# Altium project RelayModule.PrjPcb
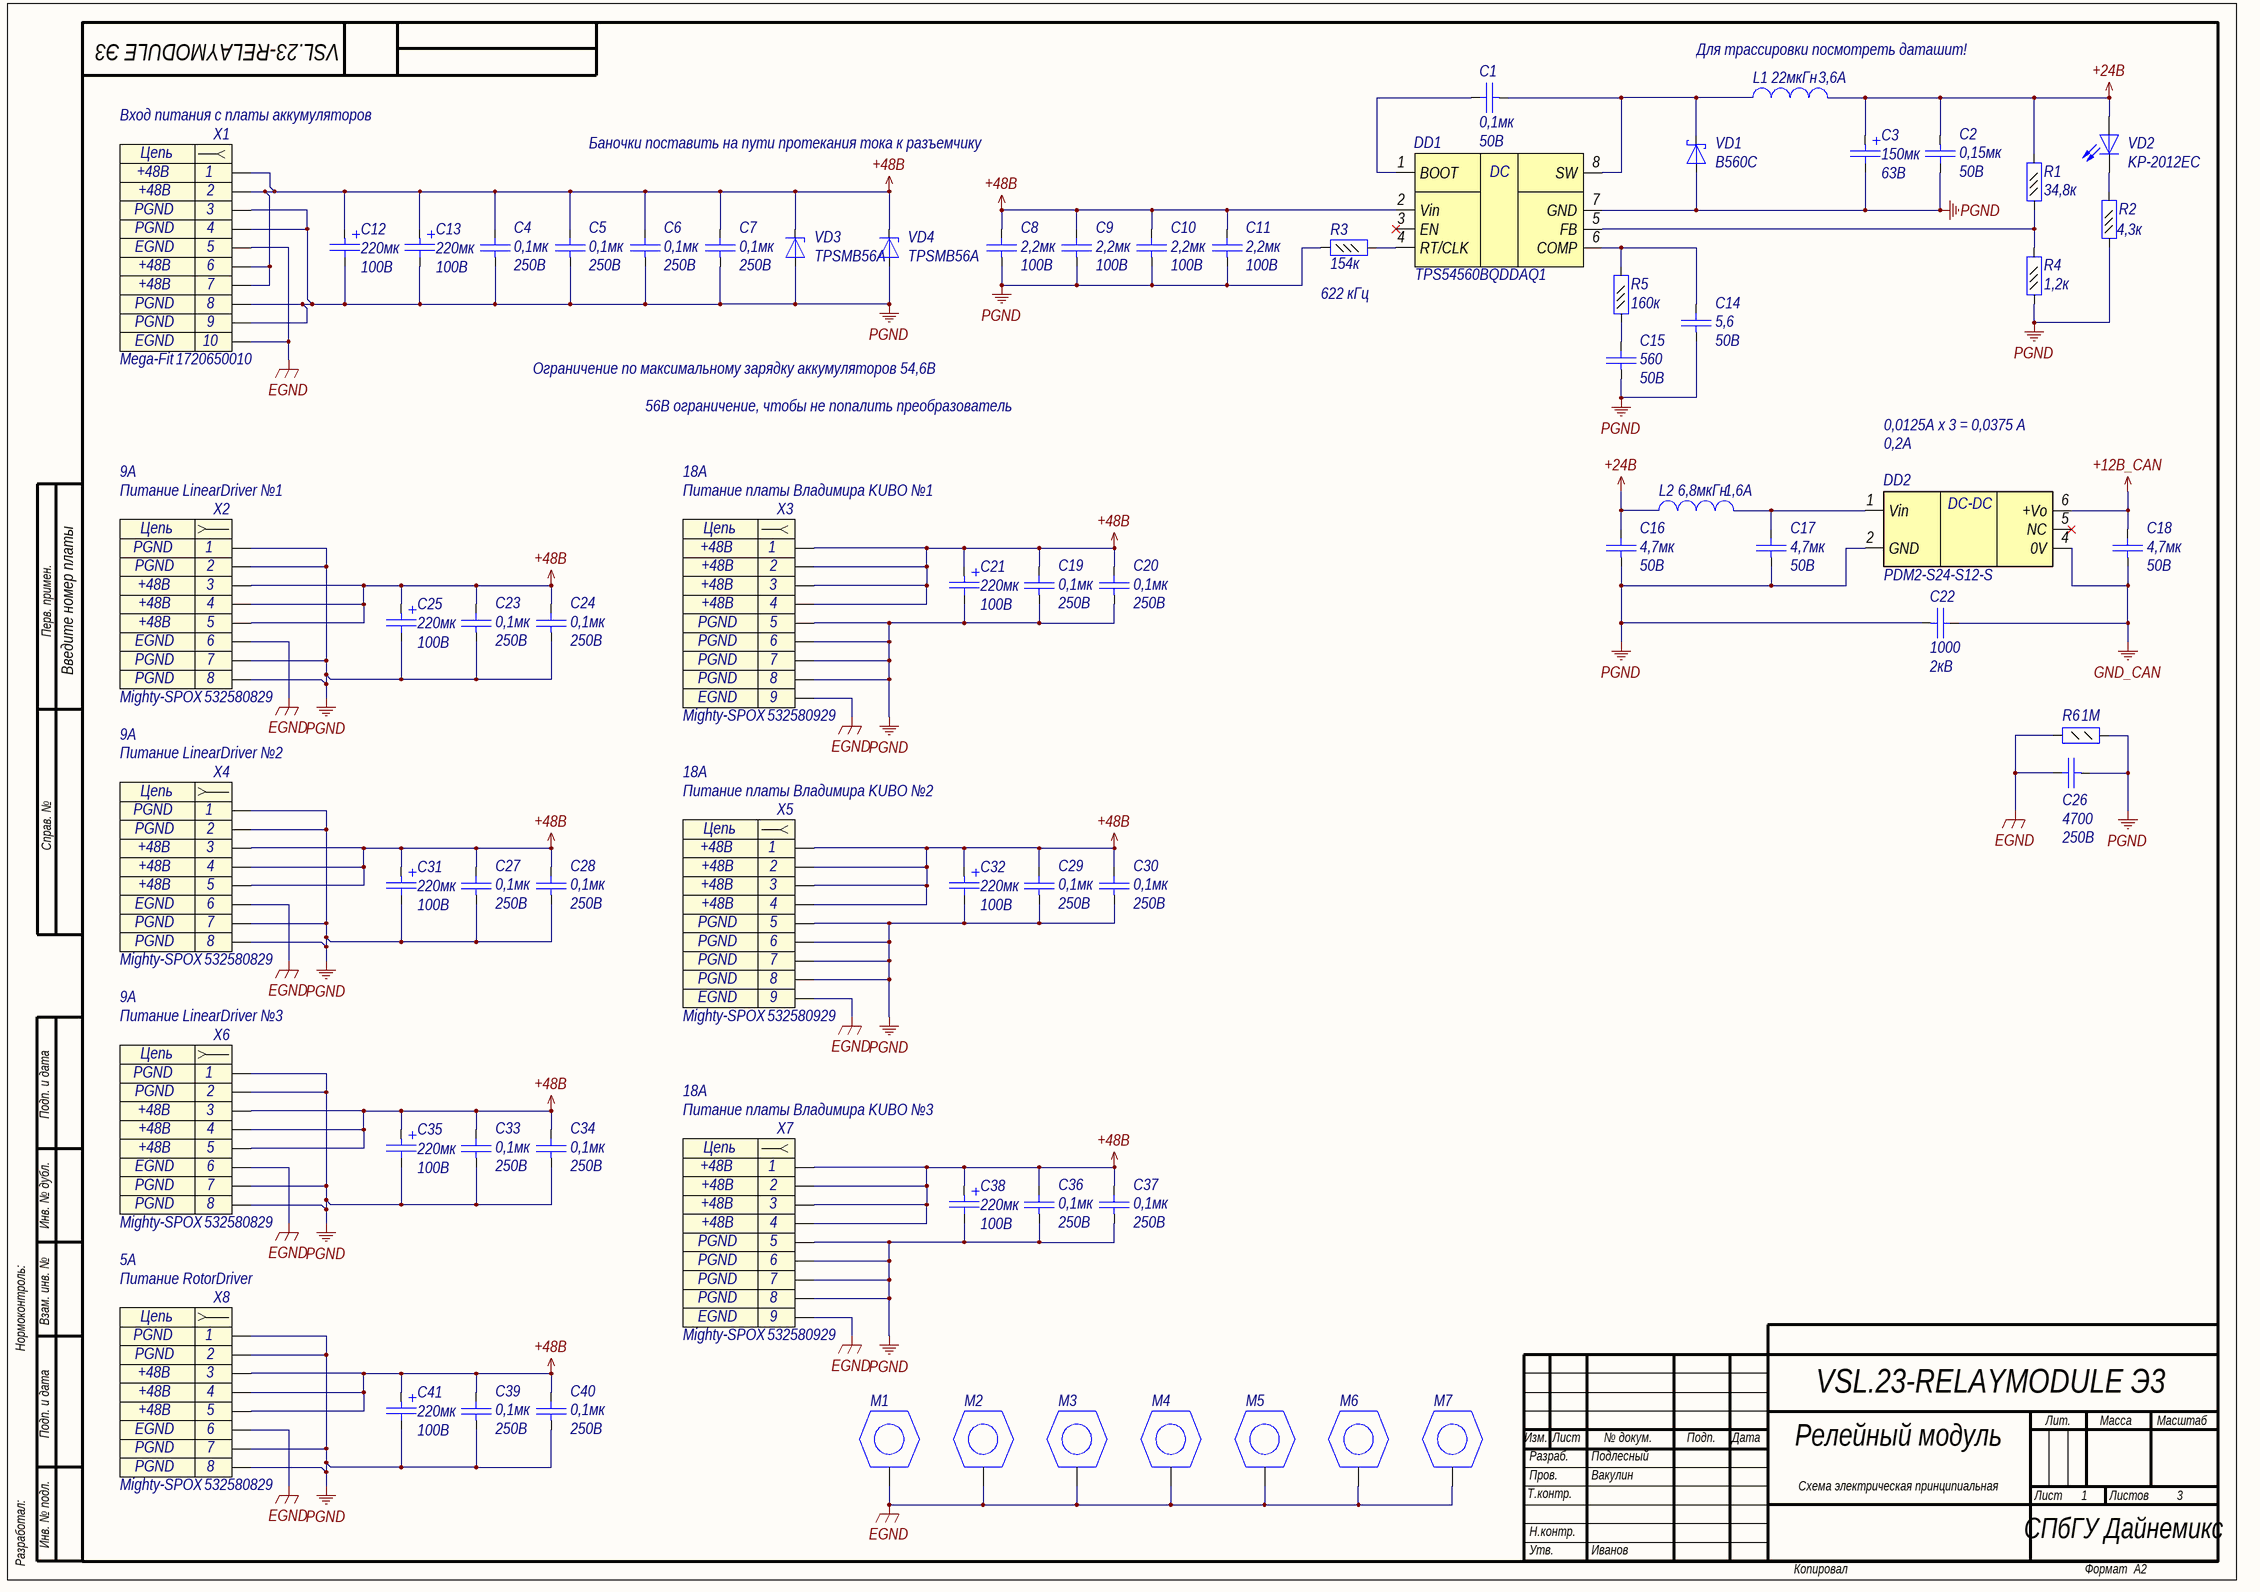
[diagram p0: RelayModule_PWR.SchDoc]
4 sheets, 158 parts. Net scope: global (net labels, ports and power ports of the same name join across sheets).
Board file: RelayModule.PcbDoc
Sheets:
  RelayModule_PWR.SchDoc
  RelayModule_RELAY.SchDoc
  RelayModule_CAN.SchDoc
  RelayModule_LED.SchDoc

## Sheet RelayModule_PWR.SchDoc: Релейный модуль
size 594 x 420 mm; ApprovedBy: Иванов; CheckedBy: Вакулин; DrawnBy: Подлесный; DocumentNumber: VSL.23-RELAYMODULE Э3; SheetNumber: 1; SheetTotal: 3; Format: A2; DocumentType: Схема электрическая принципиальная; ImagePath: Введите номер платы

### Parts
C1  Voltage: 50В  [C0402]  (hidden comment: 0,1мк)
C2  Voltage: 50В  [C1812]  (hidden comment: 0,15мк)
C3  value 150мк  Voltage: 63B  [Cap_SMD_radial_polar(10x16.5)]  (hidden comment: Capacitor_pol)
C4  value 0,1мк  Voltage: 250В  [C1206]  (hidden comment: Capacitor)
C5  value 0,1мк  Voltage: 250В  [C1206]  (hidden comment: Capacitor)
C6  value 0,1мк  Voltage: 250В  [C1206]  (hidden comment: Capacitor)
C7  value 0,1мк  Voltage: 250В  [C1206]  (hidden comment: Capacitor)
C8  Voltage: 100В  [C1812]  (hidden comment: 2,2мк)
C9  Voltage: 100В  [C1812]  (hidden comment: 2,2мк)
C10  Voltage: 100В  [C1812]  (hidden comment: 2,2мк)
C11  Voltage: 100В  [C1812]  (hidden comment: 2,2мк)
C12  value 220мк  Voltage: 100B  [K50-35(12.5X25)_V]  (hidden comment: Capacitor_pol)
C13  value 220мк  Voltage: 100B  [K50-35(12.5X25)_V]  (hidden comment: Capacitor_pol)
C14  Voltage: 50B  [C0402]  (hidden comment: 5,6)
C15  Voltage: 50B  [C0402]  (hidden comment: 560)
C16  Voltage: 50В  [C1206]  (hidden comment: 4,7мк)
C17  Voltage: 50В  [C1206]  (hidden comment: 4,7мк)
C18  Voltage: 50В  [C1206]  (hidden comment: 4,7мк)
C19  value 0,1мк  Voltage: 250В  [C1206]  (hidden comment: Capacitor)
C20  value 0,1мк  Voltage: 250В  [C1206]  (hidden comment: Capacitor)
C21  value 220мк  Voltage: 100B  [K50-35(12.5X25)_V]  (hidden comment: Capacitor_pol)
C22  Voltage: 2кB  [C1808]  (hidden comment: 1000)
C23  value 0,1мк  Voltage: 250В  [C1206]  (hidden comment: Capacitor)
C24  value 0,1мк  Voltage: 250В  [C1206]  (hidden comment: Capacitor)
C25  value 220мк  Voltage: 100B  [K50-35(12.5X25)_V]  (hidden comment: Capacitor_pol)
C26  value 4700  Voltage: 250В  [C0805]  (hidden comment: Capacitor)
C27  value 0,1мк  Voltage: 250В  [C1206]  (hidden comment: Capacitor)
C28  value 0,1мк  Voltage: 250В  [C1206]  (hidden comment: Capacitor)
C29  value 0,1мк  Voltage: 250В  [C1206]  (hidden comment: Capacitor)
C30  value 0,1мк  Voltage: 250В  [C1206]  (hidden comment: Capacitor)
C31  value 220мк  Voltage: 100B  [K50-35(12.5X25)_V]  (hidden comment: Capacitor_pol)
C32  value 220мк  Voltage: 100B  [K50-35(12.5X25)_V]  (hidden comment: Capacitor_pol)
C33  value 0,1мк  Voltage: 250В  [C1206]  (hidden comment: Capacitor)
C34  value 0,1мк  Voltage: 250В  [C1206]  (hidden comment: Capacitor)
C35  value 220мк  Voltage: 100B  [K50-35(12.5X25)_V]  (hidden comment: Capacitor_pol)
C36  value 0,1мк  Voltage: 250В  [C1206]  (hidden comment: Capacitor)
C37  value 0,1мк  Voltage: 250В  [C1206]  (hidden comment: Capacitor)
C38  value 220мк  Voltage: 100B  [K50-35(12.5X25)_V]  (hidden comment: Capacitor_pol)
C39  value 0,1мк  Voltage: 250В  [C1206]  (hidden comment: Capacitor)
C40  value 0,1мк  Voltage: 250В  [C1206]  (hidden comment: Capacitor)
C41  value 220мк  Voltage: 100B  [K50-35(12.5X25)_V]  (hidden comment: Capacitor_pol)
DD1  Part Number: TPS54560BQDDAQ1  [SO Powerpad8]  (hidden comment: TPS54560)
DD2  Part Number: PDM2-S24-S12-S  [SIP6]  (hidden comment: PDM2-Sxx-Sxx-S)
L1  value 22мкГн  Rated Current: 3,6A  [IND_12.5x12.5]  (hidden comment: Inductor)
L2  value 6,8мкГн  Rated Current: 1,6A  [SDR0604]  (hidden comment: Inductor)
M1  SCREW  [SCREW3]  (value not drawn)
M2  SCREW  [SCREW3]  (value not drawn)
M3  SCREW  [SCREW3]  (value not drawn)
M4  SCREW  [SCREW3]  (value not drawn)
M5  SCREW  [SCREW3]  (value not drawn)
M6  SCREW  [SCREW3]  (value not drawn)
M7  SCREW  [SCREW3]  (value not drawn)
R1  value 34,8к  [R0402]  (hidden comment: Resistor_0,062Вт)
R2  value 4,3к  [R0402]  (hidden comment: Resistor_0,062Вт)
R3  value 154к  [R0402]  (hidden comment: Resistor_0,062Вт)
R4  value 1,2к  [R0402]  (hidden comment: Resistor_0,062Вт)
R5  value 160к  [R0402]  (hidden comment: Resistor_0,062Вт)
R6  value 1М  [R0805]  (hidden comment: Resistor_0,125Вт)
VD1  Part Number: B560C  [SMC]  (hidden comment: DiodeSchottky)
VD2  Part Number: KP-2012EC  [L_0805]  (hidden comment: LED)
VD3  Part Number: TPSMB56A  [SMB]  (hidden comment: DiodeZener)
VD4  Part Number: TPSMB56A  [SMB]  (hidden comment: DiodeZener)
X1  Вход питания с платы аккумуляторов  Part Name: Mega-Fit  Part Number: 1720650010  [MOLEX_1720650010]
X2  Питание LinearDriver №1  Part Name: Mighty-SPOX  Part Number: 532580829  [MOLEX_532580829]
X3  Питание платы Владимира KUBO №1  Part Name: Mighty-SPOX  Part Number: 532580929  [MOLEX_532580929]
X4  Питание LinearDriver №2  Part Name: Mighty-SPOX  Part Number: 532580829  [MOLEX_532580829]
X5  Питание платы Владимира KUBO №2  Part Name: Mighty-SPOX  Part Number: 532580929  [MOLEX_532580929]
X6  Питание LinearDriver №3  Part Name: Mighty-SPOX  Part Number: 532580829  [MOLEX_532580829]
X7  Питание платы Владимира KUBO №3  Part Name: Mighty-SPOX  Part Number: 532580929  [MOLEX_532580929]
X8  Питание RotorDriver  Part Name: Mighty-SPOX  Part Number: 532580829  [MOLEX_532580829]

### Nets
+12B_CAN: C18.2 DD2.6(+Vo)
+24B: C2.1 C3.1 C16.2 L1.2 L2.1 R1.2 VD2.2(A)
+48B: C4.2 C5.2 C6.2 C7.2 C8.2 C9.2 C10.2 C11.2 C12.1 C13.1 C19.2 C20.2 C21.1 C23.2 C24.2 C25.1 C27.2 C28.2 C29.2 C30.2 C31.1 C32.1 C33.2 C34.2 C35.1 C36.2 C37.2 C38.1 C39.2 C40.2 C41.1 DD1.2(Vin) VD3.1(K) VD4.1(K) X1.1 X1.2 X1.6 X1.7 X2.3 X2.4 X2.5 X3.1 X3.2 X3.3 X3.4 X4.3 X4.4 X4.5 X5.1 X5.2 X5.3 X5.4 X6.3 X6.4 X6.5 X7.1 X7.2 X7.3 X7.4 X8.3 X8.4 X8.5
EGND: C26.2 M1.1 M2.1 M3.1 M4.1 M5.1 M6.1 M7.1 R6.2 X1.5 X1.10 X2.6 X3.9 X4.6 X5.9 X6.6 X7.9 X8.6
GND_CAN: C18.1 C22.2 DD2.4(0V)
PGND: C2.2 C3.2 C4.1 C5.1 C6.1 C7.1 C8.1 C9.1 C10.1 C11.1 C12.2 C13.2 C14.1 C15.1 C16.1 C17.1 C19.1 C20.1 C21.2 C22.1 C23.1 C24.1 C25.2 C26.1 C27.1 C28.1 C29.1 C30.1 C31.2 C32.2 C33.1 C34.1 C35.2 C36.1 C37.1 C38.2 C39.1 C40.1 C41.2 DD1.7(GND) DD2.2(GND) R2.1 R3.1 R4.1 R6.1 VD1.2(A) VD3.2(A) VD4.2(A) X1.3 X1.4 X1.8 X1.9 X2.1 X2.2 X2.7 X2.8 X3.5 X3.6 X3.7 X3.8 X4.1 X4.2 X4.7 X4.8 X5.5 X5.6 X5.7 X5.8 X6.1 X6.2 X6.7 X6.8 X7.5 X7.6 X7.7 X7.8 X8.1 X8.2 X8.7 X8.8
NetC1_1: C1.1 DD1.8(SW) L1.1 VD1.1(K)
NetC1_2: C1.2 DD1.1(BOOT)
NetC14_2: C14.2 DD1.6(COMP) R5.2
NetC15_2: C15.2 R5.1
NetC17_2: C17.2 DD2.1(Vin) L2.2
NetDD1_4: DD1.4(RT/CLK) R3.2
NetDD1_5: DD1.5(FB) R1.1 R4.2
NetR2_2: R2.2 VD2.1(K)

Not connected (* = marked no-connect by the designer): DD1 3(EN)*; DD2 5(NC)*

### Notes on the sheet
- (near L1) Для трассировки посмотреть даташит!
- Баночки поставить на пути протекания тока к разъемчику
- 622 кГц
- Ограничение по максимальному зарядку аккумуляторов 54,6В
- 56В ограничение, чтобы не попалить преобразователь
- 0,0125А х 3 = 0,0375 A
- 0,2A
- 9А
- 18А
- Перв. примен.
- Справ. №
- Подп. и дата
- Инв. № дубл.
- Нормоконтроль:
- Взам. инв. №
- 5А
- Изм.
- Лист
- № докум.
- Подп.
- Дата
- Лит.
- Масса
- Масштаб
- Т.контр.
- Пров.
- Разраб.
- Листов
- Разработал:
- Инв. № подл.
- Н.контр.
- СПбГУ Дайнемикс
- Утв.
- Копировал
- Формат
- (in symbol connect92) Цепь
- (in symbol connect108) Цепь
- (in symbol connect109) Цепь
- (in symbol pwr127) DC
- (in symbol pwr128) DC-DC

### Library data of the parts
C1 = cap277: Конденсатор; Part Name: Ceramic; Manufacture: Murata; Part Number: GRM155R71H104KE14D; id: cap277; TKE: X7R; tga: 0,10%; Value: 0,1мк
C2 = cap285: Конденсатор; Part Name: Ceramic; Manufacture: TDK; Part Number: C4532C0G1H154J250KA; id: cap285; TKE: NP0; Value: 0,15мк
C3 = cap296: Конденсатор полярный; Part Name: Electrolit Polimer; Manufacture: Panasonic; Part Number: EEH-ZS1J151P; id: cap296; tga: 0,20%; ESR: 15мОм; Iac rated: 3,5А
C4-C7 C19 C20 C23 C24 C27-C30 C33 C34 C36 C37 C39 C40 = cap179: Конденсатор; Part Name: Ceramic; Manufacture: Murata; Part Number: GRM31CR72E104K; id: cap179; TKE: X7R
C8-C11 = cap293: Конденсатор; Part Name: MLCC; Manufacture: TDK; Part Number: C4532X7R2A225M; id: cap293; TKE: X7R; tga: 0,10%; Value: 2,2мк
C12 C13 C21 C25 C31 C32 C35 C38 C41 = cap279: Конденсатор полярный; Part Name: Electrolit; Manufacture: Epcos; Part Number: B41851A9227M000; id: cap279; tga: 0,10%; ESR: 75мОм; Iac max: 0,4А; Iac rated: 0,6А
C14 = cap4: Конденсатор; Part Name: Ceramic; Manufacture: Murata; Part Number: GRM1555C1H5R6C; id: cap4; TKE: NP0; Value: 5,6
C15 = cap25: Конденсатор; Part Name: Ceramic; Manufacture: Murata; Part Number: GRM1555C1H561J; id: cap25; TKE: NP0; Value: 560
C16-C18 = cap188: Конденсатор; Part Name: Ceramic; Manufacture: Murata; Part Number: GRM31CR71H475KA12L; id: cap188; TKE: X7R; Value: 4,7мк
C22 = cap266: Конденсатор; Part Name: Ceramic; Manufacture: Murata; Part Number: GR442QR73D102KW01L; id: cap266; TKE: X7R; tga: 0,10%; Value: 1000
C26 = cap211: Конденсатор; Part Name: Ceramic; Manufacture: Murata; Part Number: GRM21AR72E472KW; id: cap211; TKE: X7R
DD1 = pwr127: 5-A, Wide Input Range, Step-Down Converter; Part Name: Step Down DC-DC Converter with Eco-mode; Manufacturer: Texas Instruments; id: pwr127; Input Voltage: 4,5-60В; Output Voltage: 0,8B-58,8B; Current: 5A; Frequency: 100 kHz-25 MHz; Type: Impulse
DD2 = pwr128: DC/DC преобразователь изолированный; Part Name: DC/DC Converter Isolated; Manufacturer: CUI INC; id: pwr128; Input Voltage: 24B; Output Voltage: 12B; Current: 167mA; Power output: 2W; Type: Isolated
L1 = ind79: EMI Suppression Filter; Part Name: SMD Power Inductors; Part Number: B82477G4223M000; Manufacture: Epcos; id: ind79; Saturation Current: 4,25A; Resistance: 0,038Ohm
L2 = ind40: EMI Suppression Filter; Part Name: SMD Power Inductors; Part Number: SDR0604-6R8ML; Manufacture: Bourns; id: ind40; Saturation Current: 2,5A; Resistance: 0,12Ohm
M1-M7 = connect89: Part Name: Винт М3 с заземлением; id: connect89
R1 = res1193: Резистор; Manufacture: Yageo; Part Number: RC0402FR-0734K8L; Accuracy: 0,01; id: res1193; Part Name: Resistor; Power: 0,062Вт
R2 = res285: Резистор; Manufacture: Yageo; Part Number: RC0402FR-074K3; id: res285; Accuracy: 0,01; Part Name: Resistor; Power: 0,062Вт
R3 = res1211: Резистор; Manufacture: Yageo; Part Number: RC0402FR-07154KL; Accuracy: 0,01; id: res1211; Part Name: Resistor; Power: 0,062Вт
R4 = res272: Резистор; Manufacture: Yageo; Part Number: RC0402FR-071K2; id: res272; Accuracy: 0,01; Part Name: Resistor; Power: 0,062Вт
R5 = res323: Резистор; Manufacture: Yageo; Part Number: RC0402FR-07160KL; id: res323; Accuracy: 0,01; Part Name: Resistor; Power: 0,062Вт
R6 = res149: Резистор; Manufacture: Yageo; Part Number: RC0805FR-071ML; id: res149; Accuracy: 0,01; Part Name: Resistor; Power: 0,125Вт
VD1 = diode32: Диод Шоттки; Part Name: SCHOTTKY BARRIER RECTIFIER; Manufacture: Diodes Incorporated; Max Reverse Voltage: 60B; Forward Voltage: 0,7B; Forward Current: 5A; Leakage current: 20mA; Capacitance: 300pF; Number of Channels: 1; id: diode32; Breakdown Voltage: 60B; Temp MAX: +150; Temp MIN: -55
VD2 = diode5: Светодиод; id: diode5; Part Name: LED
VD3 VD4 = TPSMB56A: Cтабилитрон (лавинный выпрямительный диод) односторонний; Part Name: TVS diode Unidirectional; Manufacture: Littelfuse; id: tvs285; Leakage Current: 8uA; Stand-off Voltage: 56B; Breakdown Voltage: 58,8B; Clamping voltage: 77B; Peak Pulse Power: 600W; Number of diodes: 1
X1 = connect109: Разъем - 10 конт. розетка; Manufacture: Molex; Contact_1: +48B; Contact_3: PGND; Contact_5: EGND; Etch: 5.7mm; Contact_2: +48B; Contact_4: PGND; Contact_6: +48B; id: connect109; Contact_7: +48B; Contact_8: PGND; Contact_9: PGND; Contact_10: EGND
X2 X4 X6 X8 = connect108: Разъем - 8 конт. розетка; Manufacture: Molex; Contact_1: PGND; Contact_3: +48B; Contact_6: EGND; Etch: 3.5mm; Contact_2: PGND; Contact_4: +48B; Contact_5: +48B; id: connect108; Contact_7: PGND; Contact_8: PGND
X3 X5 X7 = connect92: Разъем - 9 конт. розетка; Manufacture: Molex; Contact_1: +48B; Contact_5: PGND; Etch: 3.5mm; Contact_9: EGND; Contact_2: +48B; Contact_3: +48B; Contact_4: +48B; Contact_6: PGND; id: connect92; Contact_7: PGND; Contact_8: PGND

## Sheet RelayModule_RELAY.SchDoc
size 594 x 420 mm; DocumentNumber: VSL.23-RELAYMODULE Э3; SheetNumber: 2; Format: A2
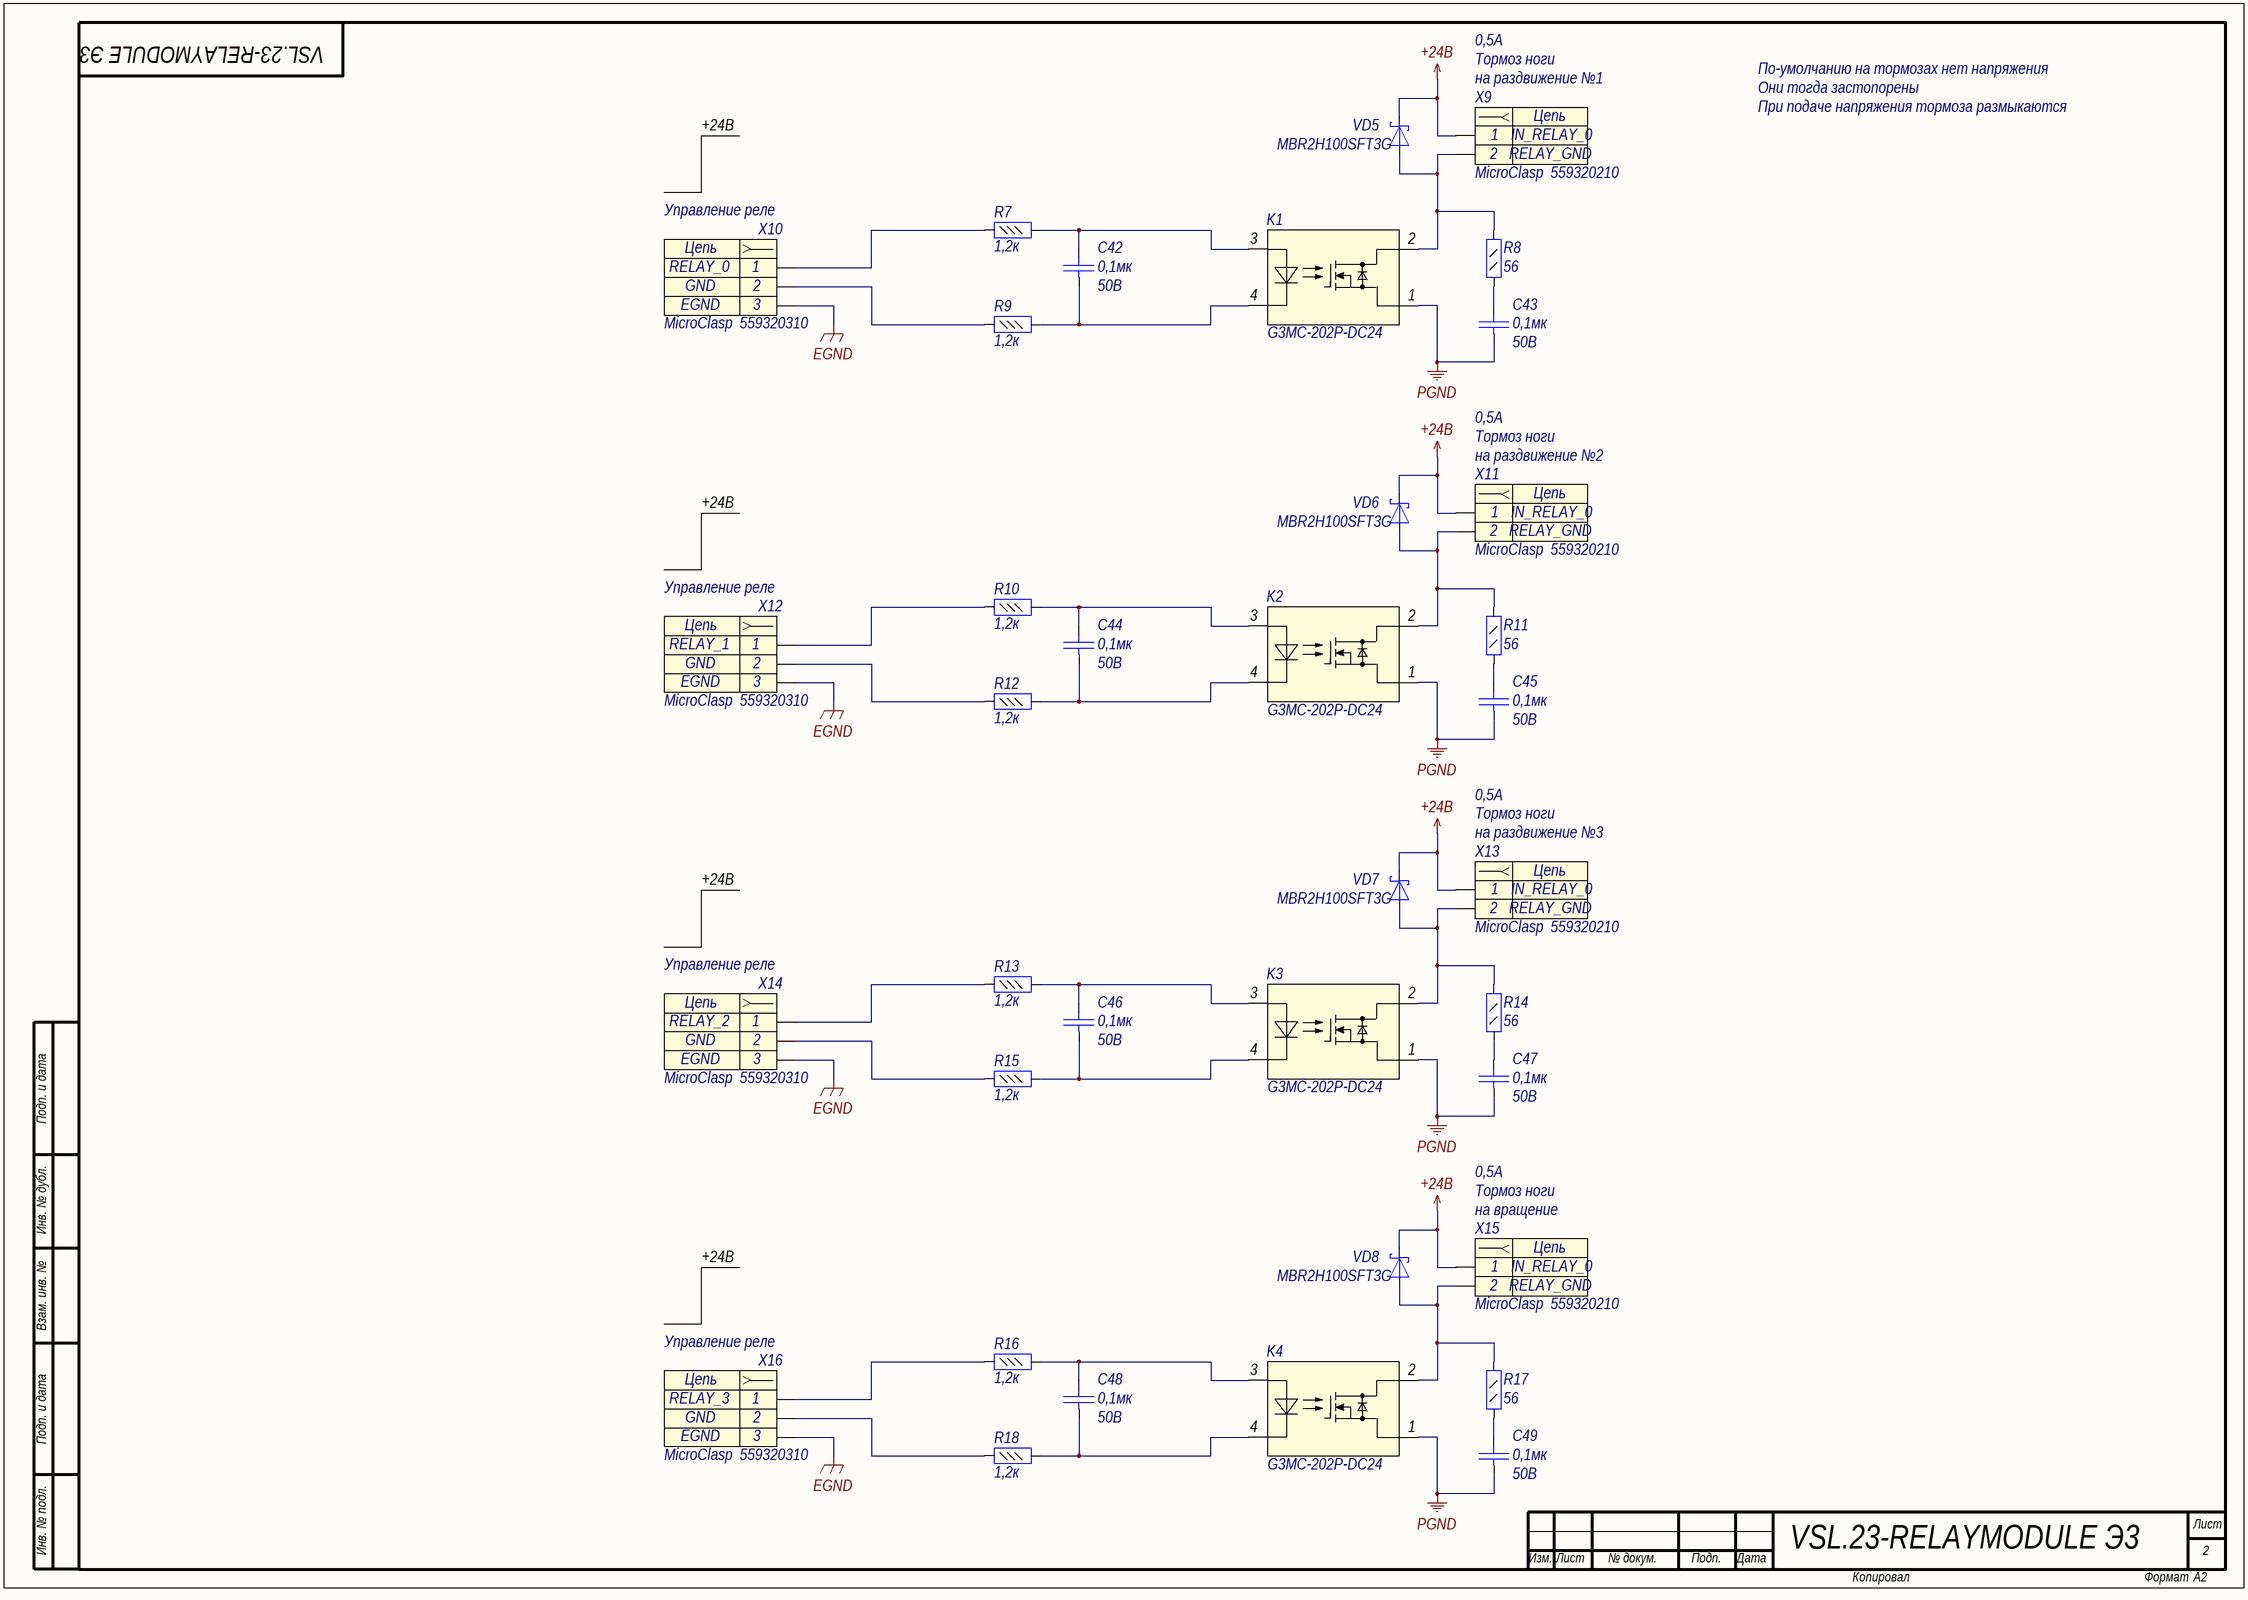
[diagram p1: RelayModule_RELAY.SchDoc]

### Parts
C42  Voltage: 50В  [C0402]  (hidden comment: 0,1мк)
C43  Voltage: 50В  [C0402]  (hidden comment: 0,1мк)
C44  Voltage: 50В  [C0402]  (hidden comment: 0,1мк)
C45  Voltage: 50В  [C0402]  (hidden comment: 0,1мк)
C46  Voltage: 50В  [C0402]  (hidden comment: 0,1мк)
C47  Voltage: 50В  [C0402]  (hidden comment: 0,1мк)
C48  Voltage: 50В  [C0402]  (hidden comment: 0,1мк)
C49  Voltage: 50В  [C0402]  (hidden comment: 0,1мк)
K1  Part Number: G3MC-202P-DC24  [SIP4]  (hidden comment: Relay_SSR)
K2  Part Number: G3MC-202P-DC24  [SIP4]  (hidden comment: Relay_SSR)
K3  Part Number: G3MC-202P-DC24  [SIP4]  (hidden comment: Relay_SSR)
K4  Part Number: G3MC-202P-DC24  [SIP4]  (hidden comment: Relay_SSR)
R7  value 1,2к  [R0402]  (hidden comment: Resistor_0,062Вт)
R8  value 56  [R0805]  (hidden comment: Resistor_0,125Вт)
R9  value 1,2к  [R0402]  (hidden comment: Resistor_0,062Вт)
R10  value 1,2к  [R0402]  (hidden comment: Resistor_0,062Вт)
R11  value 56  [R0805]  (hidden comment: Resistor_0,125Вт)
R12  value 1,2к  [R0402]  (hidden comment: Resistor_0,062Вт)
R13  value 1,2к  [R0402]  (hidden comment: Resistor_0,062Вт)
R14  value 56  [R0805]  (hidden comment: Resistor_0,125Вт)
R15  value 1,2к  [R0402]  (hidden comment: Resistor_0,062Вт)
R16  value 1,2к  [R0402]  (hidden comment: Resistor_0,062Вт)
R17  value 56  [R0805]  (hidden comment: Resistor_0,125Вт)
R18  value 1,2к  [R0402]  (hidden comment: Resistor_0,062Вт)
VD5  Part Number: MBR2H100SFT3G  [SOD-123]  (hidden comment: DiodeSchottky)
VD6  Part Number: MBR2H100SFT3G  [SOD-123]  (hidden comment: DiodeSchottky)
VD7  Part Number: MBR2H100SFT3G  [SOD-123]  (hidden comment: DiodeSchottky)
VD8  Part Number: MBR2H100SFT3G  [SOD-123]  (hidden comment: DiodeSchottky)
X9  Part Name: MicroClasp  Part Number: 559320210  [MOLEX_559320210]  (hidden comment: Header_2_sct)
X10  Управление реле  Part Name: MicroClasp  Part Number: 559320310  [MOLEX_559320310]
X11  Part Name: MicroClasp  Part Number: 559320210  [MOLEX_559320210]  (hidden comment: Header_2_sct)
X12  Управление реле  Part Name: MicroClasp  Part Number: 559320310  [MOLEX_559320310]
X13  Part Name: MicroClasp  Part Number: 559320210  [MOLEX_559320210]  (hidden comment: Header_2_sct)
X14  Управление реле  Part Name: MicroClasp  Part Number: 559320310  [MOLEX_559320310]
X15  Part Name: MicroClasp  Part Number: 559320210  [MOLEX_559320210]  (hidden comment: Header_2_sct)
X16  Управление реле  Part Name: MicroClasp  Part Number: 559320310  [MOLEX_559320310]

### Nets
+24B: VD5.1(K) VD6.1(K) VD7.1(K) VD8.1(K) X9.1 X11.1 X13.1 X15.1
EGND: X10.3 X12.3 X14.3 X16.3
PGND: C43.1 C45.1 C47.1 C49.1 K1.1 K2.1 K3.1 K4.1
NetC42_1: C42.1 K1.4 R9.2
NetC42_2: C42.2 K1.3(+) R7.2
NetC43_2: C43.2 R8.1
NetC44_1: C44.1 K2.4 R12.2
NetC44_2: C44.2 K2.3(+) R10.2
NetC45_2: C45.2 R11.1
NetC46_1: C46.1 K3.4 R15.2
NetC46_2: C46.2 K3.3(+) R13.2
NetC47_2: C47.2 R14.1
NetC48_1: C48.1 K4.4 R18.2
NetC48_2: C48.2 K4.3(+) R16.2
NetC49_2: C49.2 R17.1
NetK1_2: K1.2 R8.2 VD5.2(A) X9.2
NetK2_2: K2.2 R11.2 VD6.2(A) X11.2
NetK3_2: K3.2 R14.2 VD7.2(A) X13.2
NetK4_2: K4.2 R17.2 VD8.2(A) X15.2
NetR7_1: R7.1 X10.1
NetR9_1: R9.1 X10.2
NetR10_1: R10.1 X12.1
NetR12_1: R12.1 X12.2
NetR13_1: R13.1 X14.1
NetR15_1: R15.1 X14.2
NetR16_1: R16.1 X16.1
NetR18_1: R18.1 X16.2

### Notes on the sheet
- Тормоз ноги
- 0,5А
- на раздвижение №1
- По-умолчанию на тормозах нет напряжения
- Они тогда застопорены
- При подаче напряжения тормоза размыкаются
- +24B
- на раздвижение №2
- на раздвижение №3
- Подп. и дата
- Инв. № дубл.
- на вращение
- Взам. инв. №
- Инв. № подл.
- Лист
- Изм.
- № докум.
- Подп.
- Дата
- Копировал
- Формат
- (in symbol connect95) Цепь
- (in symbol connect96) Цепь

### Library data of the parts
C42-C49 = cap277: as C1 on sheet RelayModule_PWR; Value: 0,1мк
K1-K4 = relay2: Твердотельное реле; Part Name: Твердотельные реле; Manufacture: Omron; id: relay2; Voltage coil: 24B; Nom contact current: 2A; Contact Voltage: 19-28B
R7 R9 R10 R12 R13 R15 R16 R18 = res272: as R4 on sheet RelayModule_PWR; Part Name: Resistor; Power: 0,062Вт
R8 R11 R14 R17 = res43: Резистор; Manufacture: Yageo; Part Number: RC0805FR-0756RL; id: res43; Accuracy: 0,01; Part Name: Resistor; Power: 0,125Вт
VD5-VD8 = diode27: Диод Шоттки; Manufacture: ON Semiconductor; Max Reverse Voltage: 100B; Forward Current: 2А; Breakdown Current: 0,5mA; Number of Channels: 1; id: diode27; Part Name: Diode Schottky; Breakdown Voltage: 100B
X9 X11 X13 X15 = connect95: Разъем - 2 конт. розетка; Manufacture: Molex; Contact_1: IN_RELAY_0; Contact_2: RELAY_GND; Etch: 2mm; id: connect95
X10 = connect96: Разъем - 3 конт. розетка; Manufacture: Molex; Contact_1: RELAY_0; Contact_2: GND; Contact_3: EGND; Etch: 2mm; id: connect96
X12 = connect96: Разъем - 3 конт. розетка; Manufacture: Molex; Contact_1: RELAY_1; Contact_2: GND; Contact_3: EGND; Etch: 2mm; id: connect96
X14 = connect96: Разъем - 3 конт. розетка; Manufacture: Molex; Contact_1: RELAY_2; Contact_2: GND; Contact_3: EGND; Etch: 2mm; id: connect96
X16 = connect96: Разъем - 3 конт. розетка; Manufacture: Molex; Contact_1: RELAY_3; Contact_2: GND; Contact_3: EGND; Etch: 2mm; id: connect96

## Sheet RelayModule_CAN.SchDoc
size 420 x 297 mm; DocumentNumber: VSL.23-RELAYMODULE Э3; SheetNumber: 3; Format: A3
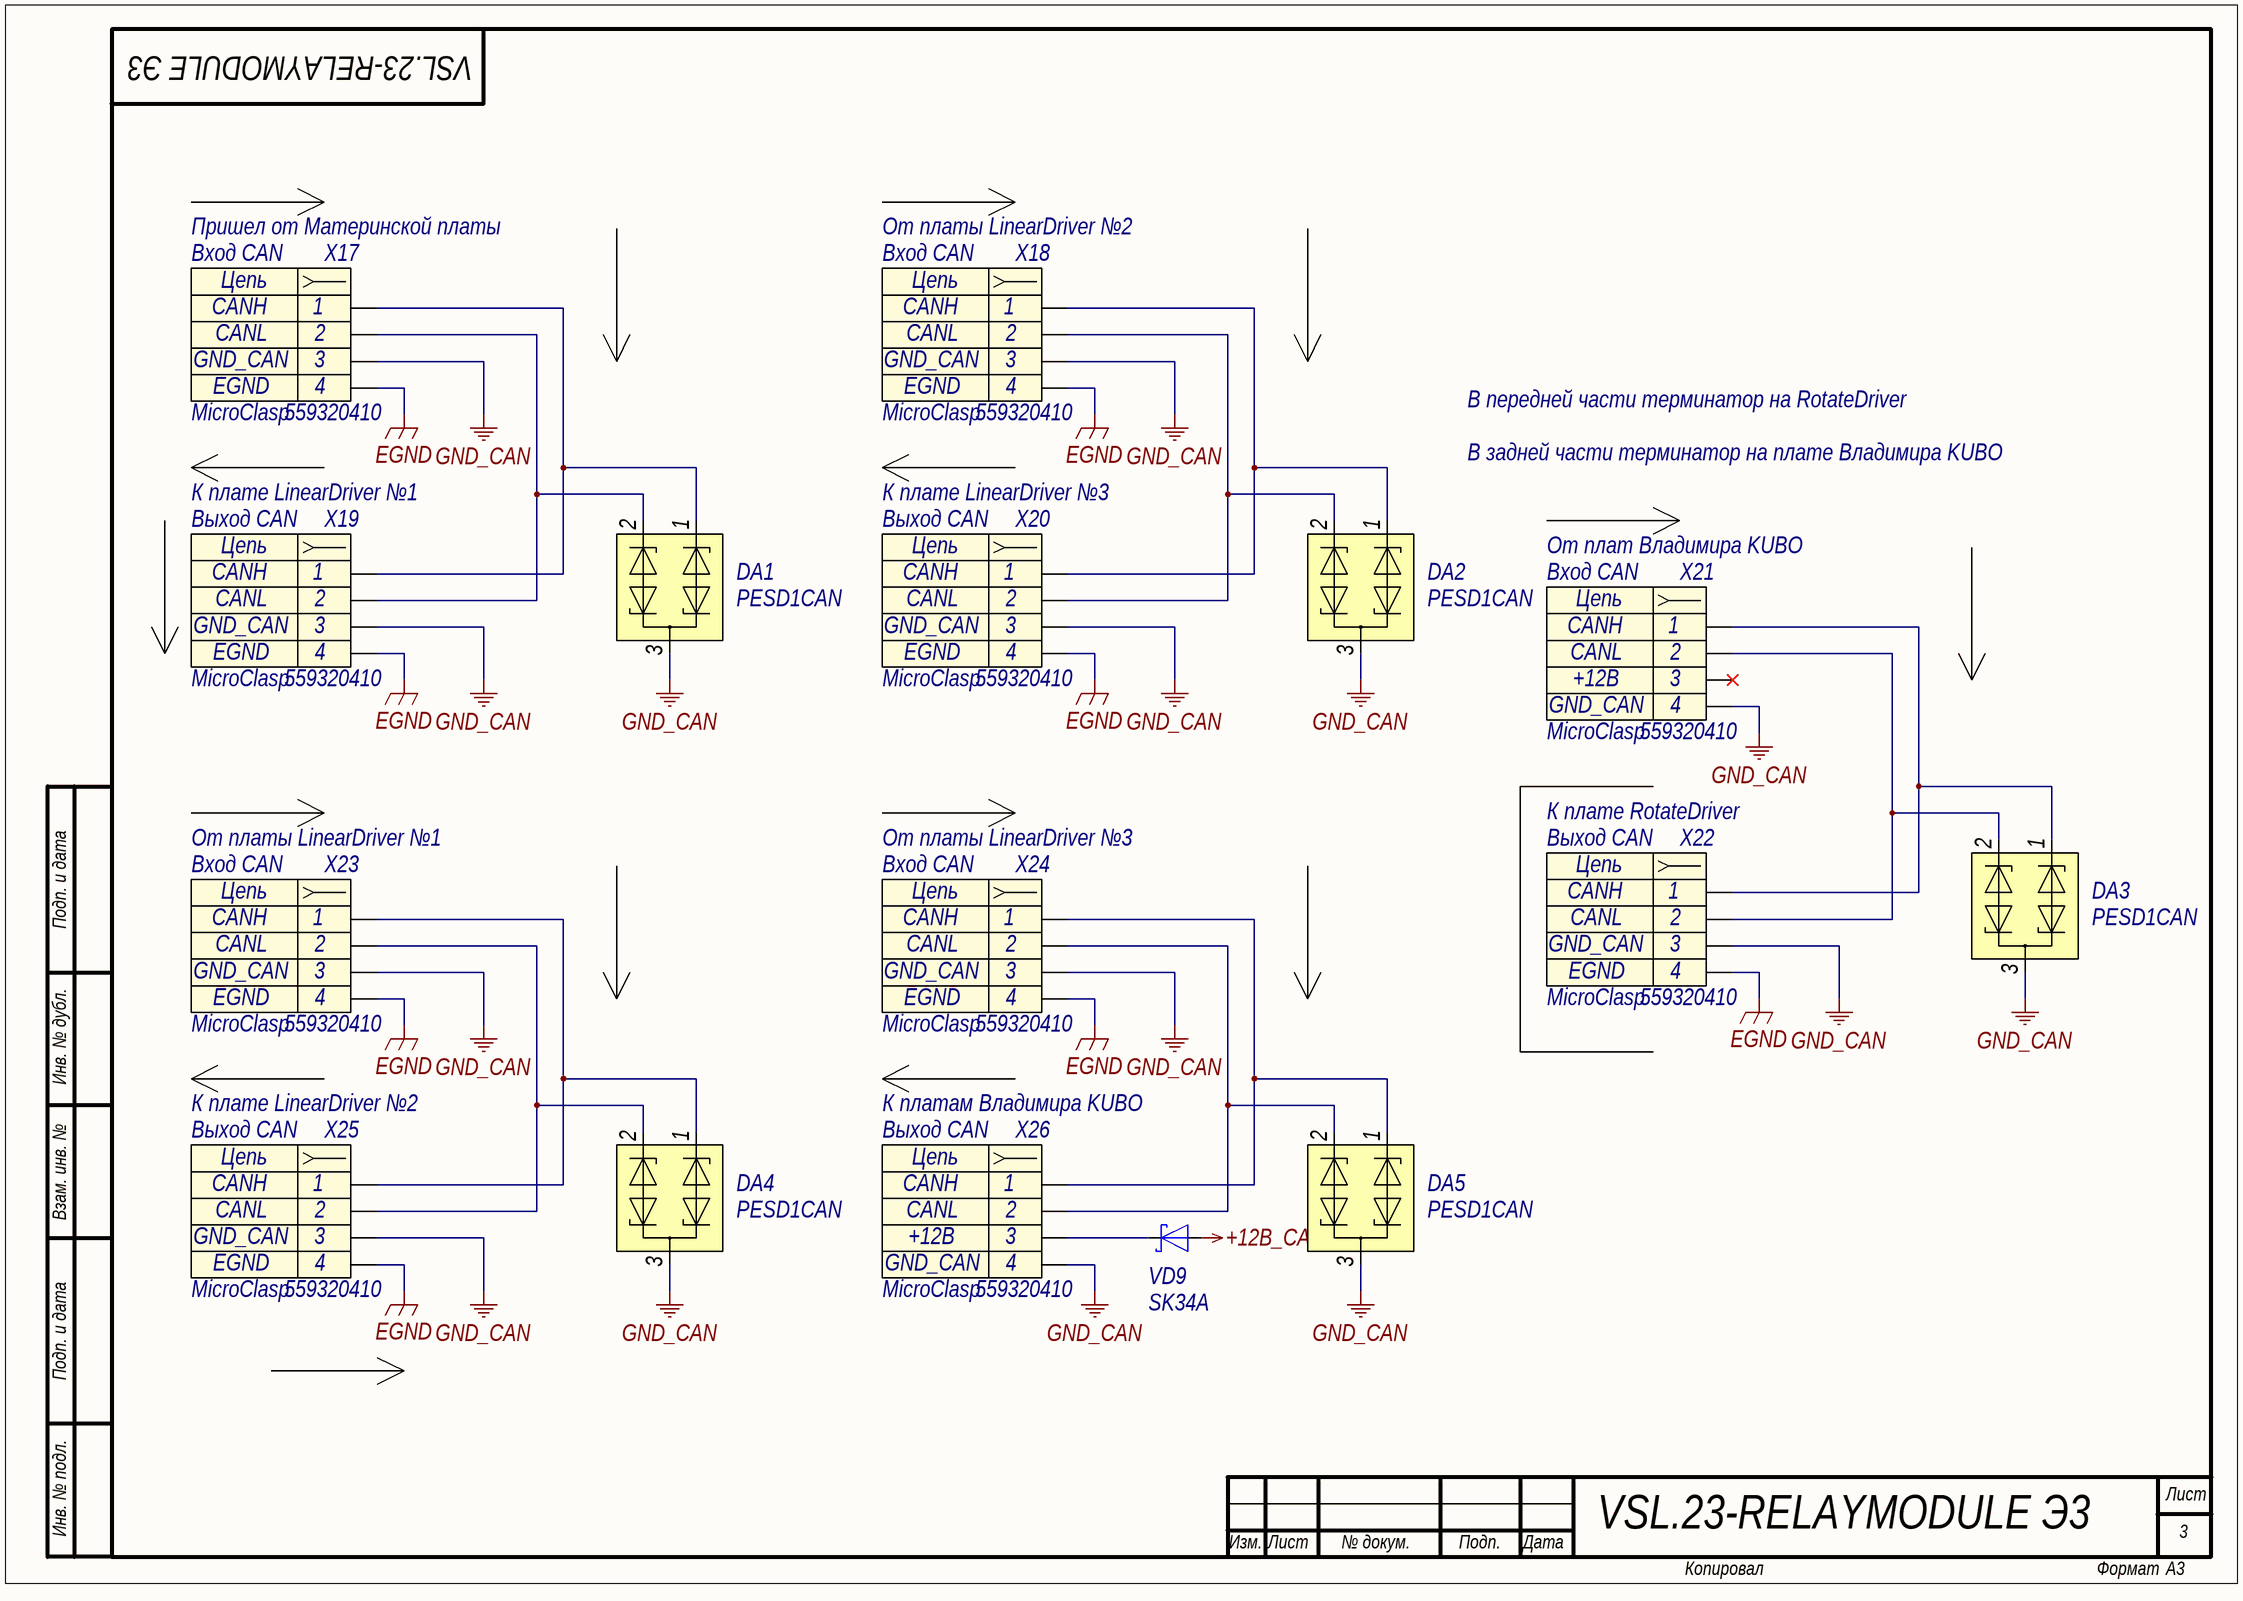
[diagram p2: RelayModule_CAN.SchDoc]

### Parts
DA1  Part Number: PESD1CAN  [SOT23-3]  (hidden comment: PESD)
DA2  Part Number: PESD1CAN  [SOT23-3]  (hidden comment: PESD)
DA3  Part Number: PESD1CAN  [SOT23-3]  (hidden comment: PESD)
DA4  Part Number: PESD1CAN  [SOT23-3]  (hidden comment: PESD)
DA5  Part Number: PESD1CAN  [SOT23-3]  (hidden comment: PESD)
VD9  Part Number: SK34A  [SMA]  (hidden comment: DiodeSchottky)
X17  Вход CAN  Part Name: MicroClasp  Part Number: 559320410  [MOLEX_559320410]
X18  Вход CAN  Part Name: MicroClasp  Part Number: 559320410  [MOLEX_559320410]
X19  Выход CAN  Part Name: MicroClasp  Part Number: 559320410  [MOLEX_559320410]
X20  Выход CAN  Part Name: MicroClasp  Part Number: 559320410  [MOLEX_559320410]
X21  Вход CAN  Part Name: MicroClasp  Part Number: 559320410  [MOLEX_559320410]
X22  Выход CAN  Part Name: MicroClasp  Part Number: 559320410  [MOLEX_559320410]
X23  Вход CAN  Part Name: MicroClasp  Part Number: 559320410  [MOLEX_559320410]
X24  Вход CAN  Part Name: MicroClasp  Part Number: 559320410  [MOLEX_559320410]
X25  Выход CAN  Part Name: MicroClasp  Part Number: 559320410  [MOLEX_559320410]
X26  Выход CAN  Part Name: MicroClasp  Part Number: 559320410  [MOLEX_559320410]

### Nets
+12B_CAN: VD9.2(A)
EGND: X17.4 X18.4 X19.4 X20.4 X22.4 X23.4 X24.4 X25.4
GND_CAN: DA1.3 DA2.3 DA3.3 DA4.3 DA5.3 X17.3 X18.3 X19.3 X20.3 X21.4 X22.3 X23.3 X24.3 X25.3 X26.4
NetDA1_1: DA1.1 X17.1 X19.1
NetDA1_2: DA1.2 X17.2 X19.2
NetDA2_1: DA2.1 X18.1 X20.1
NetDA2_2: DA2.2 X18.2 X20.2
NetDA3_1: DA3.1 X21.1 X22.1
NetDA3_2: DA3.2 X21.2 X22.2
NetDA4_1: DA4.1 X23.1 X25.1
NetDA4_2: DA4.2 X23.2 X25.2
NetDA5_1: DA5.1 X24.1 X26.1
NetDA5_2: DA5.2 X24.2 X26.2
NetVD9_1: VD9.1(K) X26.3

Not connected (* = marked no-connect by the designer): X21 3*

### Notes on the sheet
- Пришел от Материнской платы
- От платы LinearDriver №2
- В передней части терминатор на RotateDriver
- В задней части терминатор на плате Владимира KUBO
- К плате LinearDriver №1
- К плате LinearDriver №3
- От плат Владимира KUBO
- От платы LinearDriver №1
- От платы LinearDriver №3
- К плате RotateDriver
- Подп. и дата
- Инв. № дубл.
- К плате LinearDriver №2
- К платам Владимира KUBO
- Взам. инв. №
- Инв. № подл.
- Лист
- Изм.
- № докум.
- Подп.
- Дата
- Копировал
- Формат
- (in symbol connect97) Цепь

### Library data of the parts
DA1-DA5 = PESD1CAN: TVS; Part Name: CAN bus ESD protection diode; Manufacture: Nexperia; id: esd5; Max Reverse Voltage: 24B; Breakdown Voltage: 25,4B; Capacitance: 17pF; Number of Channels: 2
VD9 = diode1: Диод Шоттки; Manufacture: Taiwan Semiconductor; id: diode1; Max Reverse Voltage: 40B; Forward Voltage: 0,55B; Forward Current: 3A; Part Name: Diode Schottky
X17-X20 X22-X25 = connect97: Разъем - 4 конт. розетка; Manufacture: Molex; Contact_1: CANH; Contact_2: CANL; Contact_3: GND_CAN; Contact_4: EGND; Etch: 2mm; id: connect97
X21 X26 = connect97: Разъем - 4 конт. розетка; Manufacture: Molex; Contact_1: CANH; Contact_2: CANL; Contact_3: +12B; Contact_4: GND_CAN; Etch: 2mm; id: connect97

## Sheet RelayModule_LED.SchDoc
size 420 x 297 mm; DocumentNumber: VSL.23-RELAYMODULE Э3; SheetNumber: 4; Format: A3
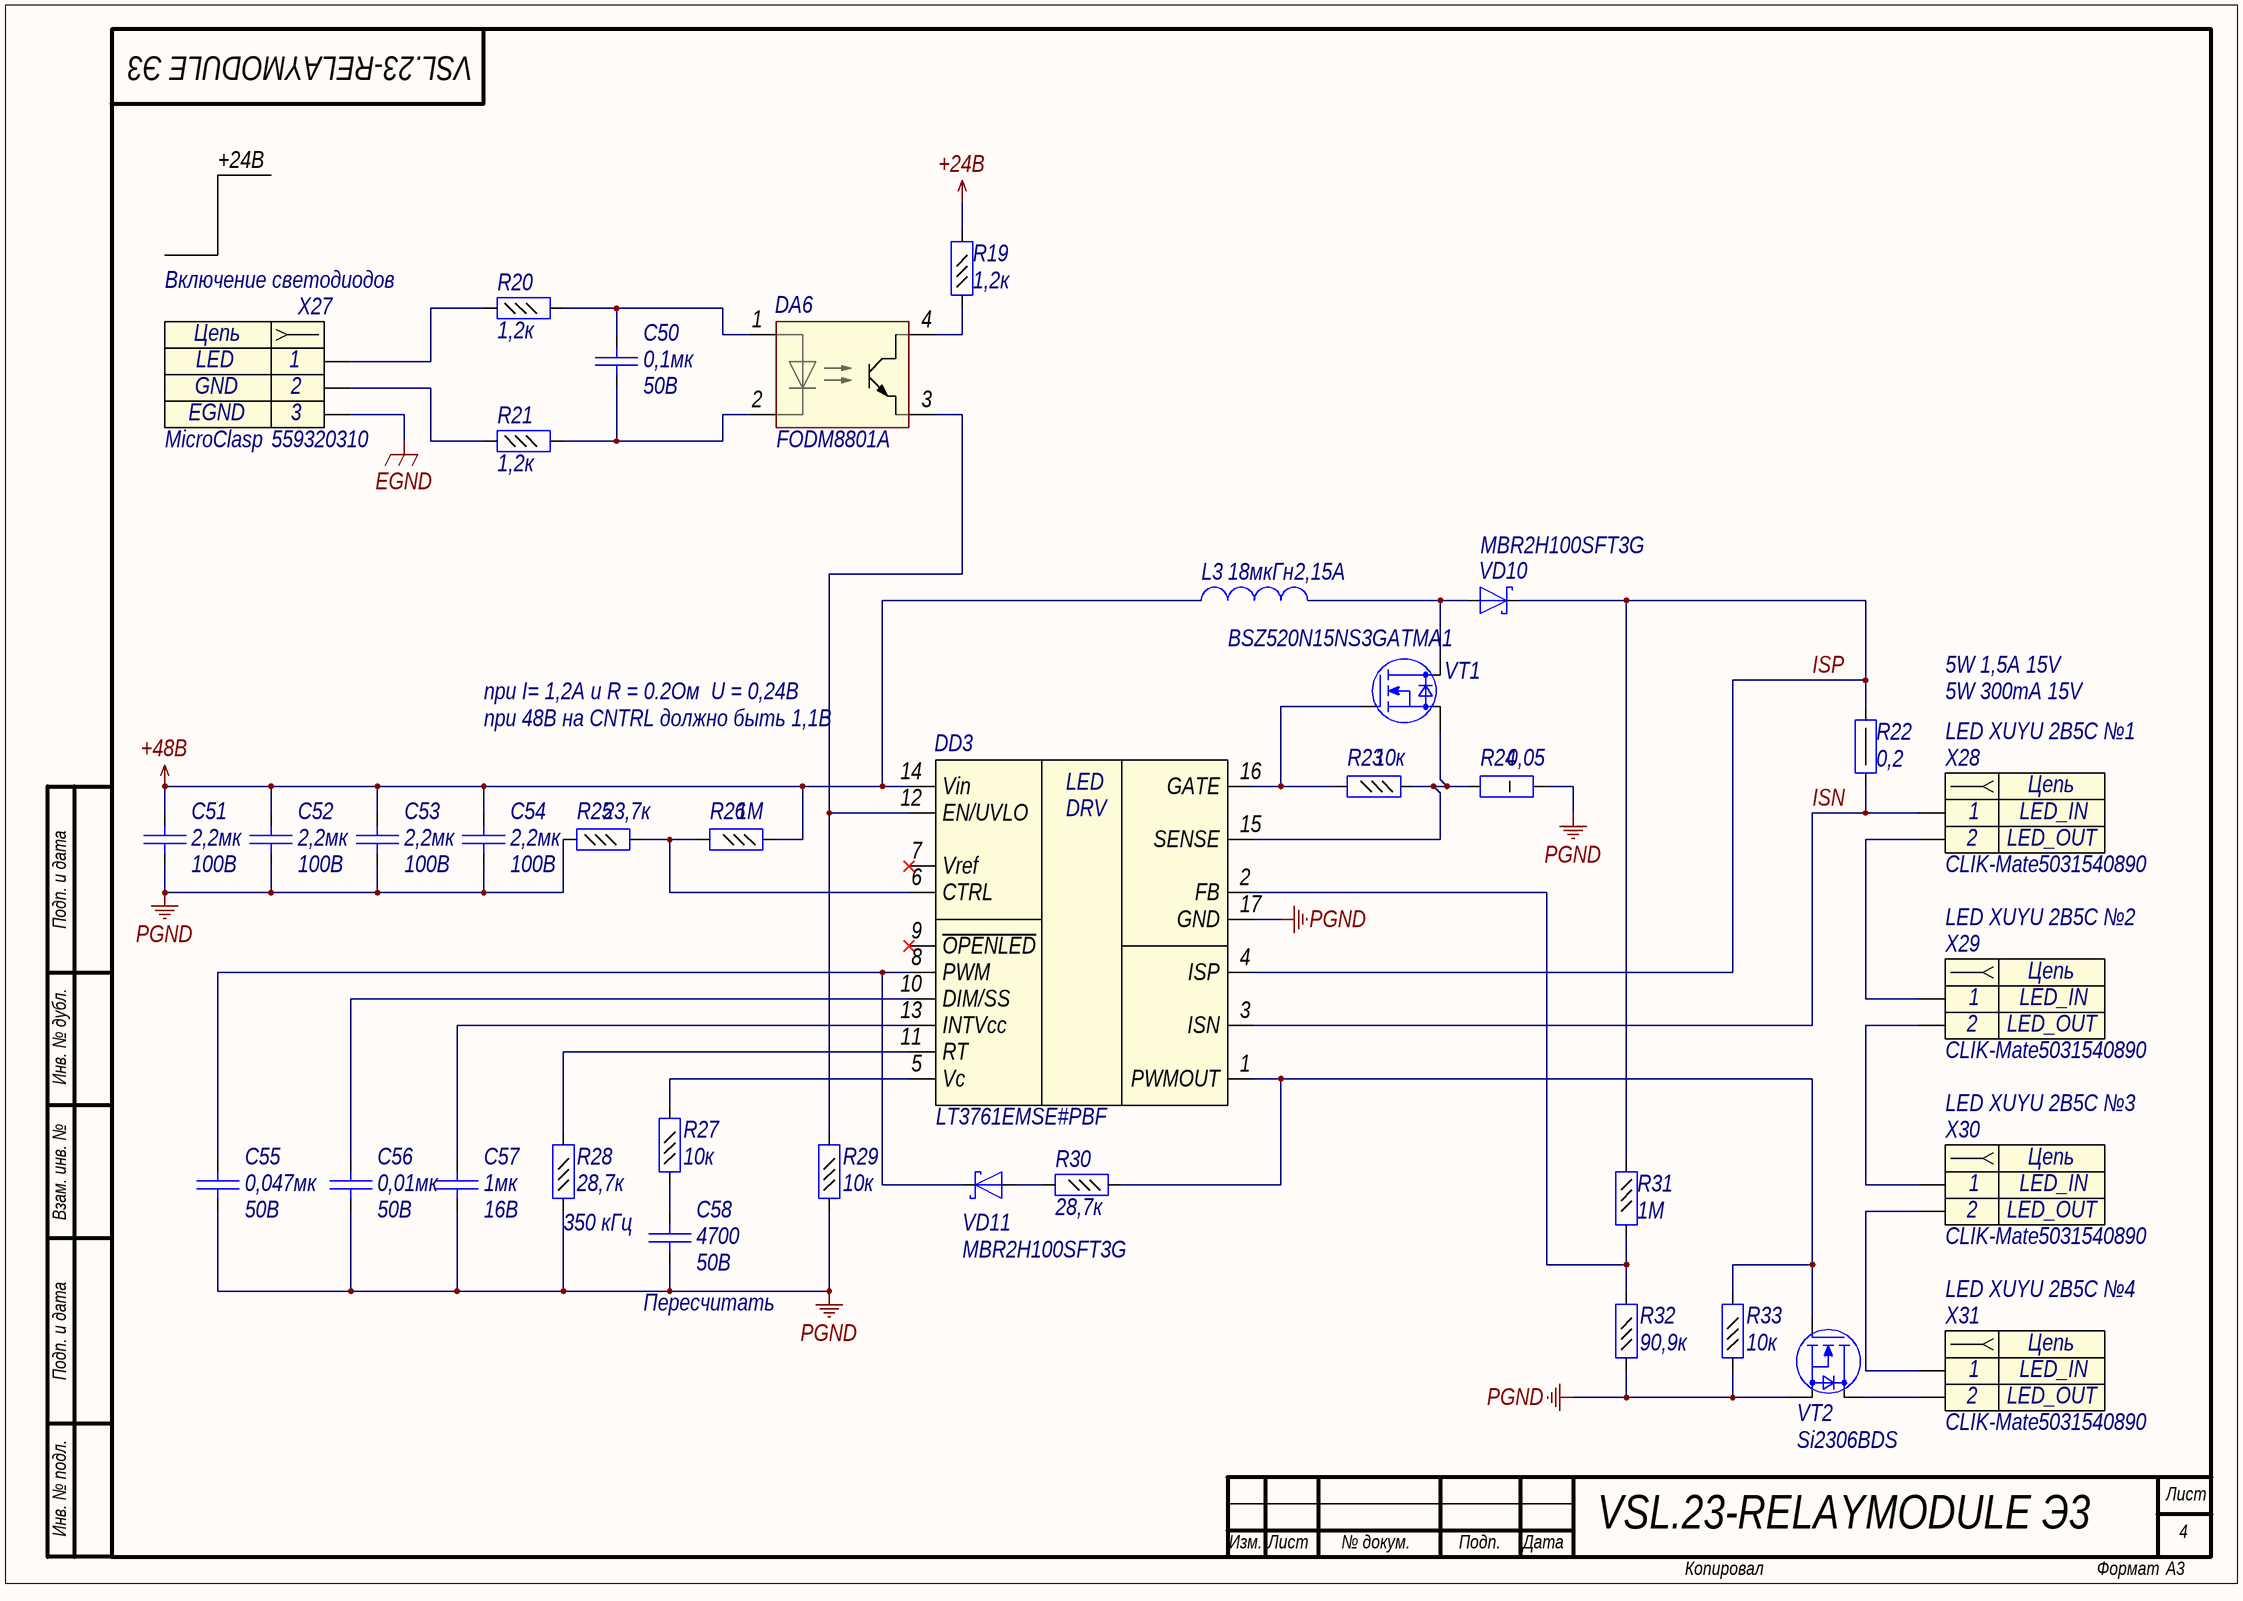
[diagram p3: RelayModule_LED.SchDoc]

### Parts
C50  Voltage: 50В  [C0402]  (hidden comment: 0,1мк)
C51  Voltage: 100В  [C1812]  (hidden comment: 2,2мк)
C52  Voltage: 100В  [C1812]  (hidden comment: 2,2мк)
C53  Voltage: 100В  [C1812]  (hidden comment: 2,2мк)
C54  Voltage: 100В  [C1812]  (hidden comment: 2,2мк)
C55  Voltage: 50В  [C0402]  (hidden comment: 0,047мк)
C56  Voltage: 50B  [C0402]  (hidden comment: 0,01мк)
C57  value 1мк  Voltage: 16B  [C0603]  (hidden comment: Capacitor)
C58  Voltage: 50B  [C0402]  (hidden comment: 4700)
DA6  Part Number: FODM8801A  [Miniflat4]  (hidden comment: OPTO-1)
DD3  Part Number: LT3761EMSE#PBF  [MSOP16]  (hidden comment: LT3761)
L3  value 18мкГн  Rated Current: 2,15A  [SDR1006]  (hidden comment: Inductor)
R19  value 1,2к  [R0402]  (hidden comment: Resistor_0,062Вт)
R20  value 1,2к  [R0402]  (hidden comment: Resistor_0,062Вт)
R21  value 1,2к  [R0402]  (hidden comment: Resistor_0,062Вт)
R22  value 0,2  [R1210]  (hidden comment: Resistor_0,5Вт)
R23  value 10к  [R0402]  (hidden comment: Resistor_0,062Вт)
R24  value 0,05  [R2010]  (hidden comment: Resistor_1Вт)
R25  value 23,7к  [R0402]  (hidden comment: Resistor_0,062Вт)
R26  value 1М  [R0402]  (hidden comment: Resistor_0,062Вт)
R27  value 10к  [R0402]  (hidden comment: Resistor_0,062Вт)
R28  value 28,7к  [R0402]  (hidden comment: Resistor_0,062Вт)
R29  value 10к  [R0402]  (hidden comment: Resistor_0,062Вт)
R30  value 28,7к  [R0402]  (hidden comment: Resistor_0,062Вт)
R31  value 1М  [R0402]  (hidden comment: Resistor_0,062Вт)
R32  value 90,9к  [R0402]  (hidden comment: Resistor_0,062Вт)
R33  value 10к  [R0402]  (hidden comment: Resistor_0,062Вт)
VD10  Part Number: MBR2H100SFT3G  [SOD-123]  (hidden comment: DiodeSchottky)
VD11  Part Number: MBR2H100SFT3G  [SOD-123]  (hidden comment: DiodeSchottky)
VT1  Part Number: BSZ520N15NS3GATMA1  [TSDSON8]  (hidden comment: N-MOSFET)
VT2  Part Number: Si2306BDS  [SOT23-3]  (hidden comment: N-MOSFET)
X27  Включение светодиодов  Part Name: MicroClasp  Part Number: 559320310  [MOLEX_559320310]
X28  LED XUYU 2B5C №1  Part Name: CLIK-Mate  Part Number: 5031540890  [MOLEX_5031540890]
X29  LED XUYU 2B5C №2  Part Name: CLIK-Mate  Part Number: 5031540890  [MOLEX_5031540890]
X30  LED XUYU 2B5C №3  Part Name: CLIK-Mate  Part Number: 5031540890  [MOLEX_5031540890]
X31  LED XUYU 2B5C №4  Part Name: CLIK-Mate  Part Number: 5031540890  [MOLEX_5031540890]

### Nets
+24B: R19.2
+48B: C51.2 C52.2 C53.2 C54.2 DD3.14(Vin) L3.1 R26.1
EGND: X27.3
PGND: C51.1 C52.1 C53.1 C54.1 C55.1 C56.1 C57.1 C58.1 DD3.17(GND) R24.2 R25.1 R28.1 R29.1 R32.1 R33.1 VT2.3(S)
ISN: DD3.3(ISN) R22.2 X28.1
ISP: DD3.4(ISP) R22.1 R31.1 VD10.1(K)
NetC50_1: C50.1 DA6.2 R21.2
NetC50_2: C50.2 DA6.1 R20.2
NetC55_2: C55.2 DD3.8(PWM) VD11.1(K)
NetC56_2: C56.2 DD3.10(DIM/SS)
NetC57_2: C57.2 DD3.13(INTVcc)
NetC58_2: C58.2 R27.1
NetDA6_3: DA6.3 DD3.12(EN/UVLO) R29.2
NetDA6_4: DA6.4 R19.1
NetDD3_1: DD3.1(PWMOUT) R30.1 R33.2 VT2.1(G)
NetDD3_2: DD3.2(FB) R31.2 R32.2
NetDD3_5: DD3.5(Vc) R27.2
NetDD3_6: DD3.6(CTRL) R25.2 R26.2
NetDD3_11: DD3.11(RT) R28.2
NetDD3_15: DD3.15(SENSE) R23.1 R24.1 VT1.3(S)
NetDD3_16: DD3.16(GATE) R23.2 VT1.1(G)
NetL3_2: L3.2 VD10.2(A) VT1.2(D)
NetR20_1: R20.1 X27.1
NetR21_1: R21.1 X27.2
NetR30_2: R30.2 VD11.2(A)
NetVT2_2: VT2.2(D) X31.2
NetX28_2: X28.2 X29.1
NetX29_2: X29.2 X30.1
NetX30_2: X30.2 X31.1

Not connected (* = marked no-connect by the designer): DD3 7(Vref)* 9(~{OPENLED})*

### Notes on the sheet
- +24B
- при 48B на CNTRL должно быть 1,1В
- при I= 1,2А и R = 0.2Ом  U = 0,24B
- 5W 300mA 15V
- 5W 1,5A 15V
- Подп. и дата
- Инв. № дубл.
- Взам. инв. №
- 350 кГц
- (near C58) Пересчитать
- Инв. № подл.
- Лист
- Изм.
- № докум.
- Подп.
- Дата
- Копировал
- Формат
- (in symbol connect96) Цепь
- (in symbol connect112) Цепь
- (in symbol driver28) LED; DRV

### Library data of the parts
C50 = cap277: as C1 on sheet RelayModule_PWR; Value: 0,1мк
C51-C54 = cap293: as C8 on sheet RelayModule_PWR; Value: 2,2мк
C55 = cap298: Конденсатор; Part Name: Ceramic; Manufacture: Yageo; Part Number: CC0402KRX7R9BB473; id: cap298; TKE: X7R; tga: 0,10%; Value: 0,047мк
C56 = cap42: Конденсатор; Part Name: Ceramic; Manufacture: Murata; Part Number: GRM155R71H103K; id: cap42; TKE: X7R; Value: 0,01мк
C57 = cap133: Конденсатор; Part Name: Ceramic; Manufacture: Murata; Part Number: GRM188R71C105KA12D**; id: cap133; TKE: X7R
C58 = cap37: Конденсатор; Part Name: Ceramic; Manufacture: Murata; Part Number: GRM155R71H472K; id: cap37; TKE: X7R; Value: 4700
DA6 = FODM8801A: Опторазвязка; Manufacturer: ON Semiconductor; id: opto2; Forward current: 20мА; Forward Voltage: 1,8B; Reverse voltage: 6B; Continuous collector current: 30mA; Voltage coll-emmiter: 75B; Max tempreture: +125; Min tempreture: -40; Power dissipation: 300mW
DD3 = driver28: LED Controller with  Internal PWM Generato; Part Name: 60VIN LED Controller with Internal PWM Generator; Manufacture: Analog Devices; Min Operating Supply Voltage: 4,5B; Max Operating Supply Voltage: 60B; Maximum output current: 10A; id: driver28
L3 = ind102: EMI Suppression Filter; Part Name: SMD Power Inductors; Part Number: SDR1006- 180ML; Manufacture: Bourns; id: ind102; Saturation Current: 3,8A; Resistance: 0,090Ohm
R19-R21 = res272: as R4 on sheet RelayModule_PWR; Part Name: Resistor; Power: 0,062Вт
R22 = RL1210FR-070R2L: Резистор; Part Name: Current Sense Resistors; Manufacture: Yageo; id: shunt3; Accuracy: 0,01; Power: 0,5Вт; Part Number: RL1210FR-070R2L
R23 R27 R29 R33 = res294: Резистор; Manufacture: Yageo; Part Number: RC0402FR-0710KL; id: res294; Accuracy: 0,01; Part Name: Resistor; Power: 0,062Вт
R24 = RL2010FK-070R05L: Резистор; Part Name: Current Sense Resistors; Manufacture: Yageo; id: shunt6; Accuracy: 0,01; Power: 0,75Вт; Part Number: RL2010FK-070R05L
R25 = res1171: Резистор; Manufacture: Yageo; Part Number: RC0402FR-0723K7L; Accuracy: 0,01; id: res1171; Part Name: Resistor; Power: 0,062Вт
R26 R31 = res342: Резистор; Manufacture: Yageo; Part Number: RC0402FR-071ML; id: res342; Accuracy: 0,01; Part Name: Resistor; Power: 0,062Вт
R28 R30 = res1196: Резистор; Manufacture: Yageo; Part Number: RC0402FR-0728K7L; Accuracy: 0,01; id: res1196; Part Name: Resistor; Power: 0,062Вт
R32 = res1205: Резистор; Manufacture: Yageo; Part Number: RC0402FR-0790K9L; Accuracy: 0,01; id: res1205; Part Name: Resistor; Power: 0,062Вт
VD10 VD11 = diode27: as VD5 on sheet RelayModule_RELAY; id: diode27; Part Name: Diode Schottky; Breakdown Voltage: 100B
VT1 = mosfert23: Manufacturer: Infineon Technologies; Structure: n-channel; V drain-source max: 150B; Rds: 0,052Ohm; Gate-to-source voltage: (+-)20B; Continuous drain current: 21A; Total gate charge: 12nC; Pulsed drain current: 84A; Power dissipation: 57W; id: mosfert23
VT2 = mosfert25: Manufacturer: Vishay; Structure: n-channel; V drain-source max: 30B; Rds: 0,047Ohm; Gate-to-source voltage: (+-)20B; Continuous drain current: 4A; Total gate charge: 9nC; Pulsed drain current: 20A; Power dissipation: 0,75W; id: mosfert25
X27 = connect96: Разъем - 3 конт. розетка; Manufacture: Molex; Contact_1: LED; Contact_2: GND; Contact_3: EGND; Etch: 2mm; id: connect96
X28-X31 = connect112: Разъем - 2 конт. розетка; Manufacture: Molex; Contact_1: LED_IN; Contact_2: LED_OUT; Etch: 1.25mm; id: connect112

## Nets that join several sheets
+12B_CAN: RelayModule_PWR (C18.2 DD2.6), RelayModule_CAN (VD9.2)
+24B: RelayModule_PWR (7 pins), RelayModule_RELAY (8 pins), RelayModule_LED (R19.2)
+48B: RelayModule_PWR (62 pins), RelayModule_LED (7 pins)
EGND: RelayModule_PWR (18 pins), RelayModule_RELAY (X10.3 X12.3 X14.3 X16.3), RelayModule_CAN (8 pins), RelayModule_LED (X27.3)
GND_CAN: RelayModule_PWR (C18.1 C22.2 DD2.4), RelayModule_CAN (15 pins)
PGND: RelayModule_PWR (80 pins), RelayModule_RELAY (8 pins), RelayModule_LED (16 pins)